# EAGLE schematic imu-6dof_tof_board (EAGLE 9.6.2)
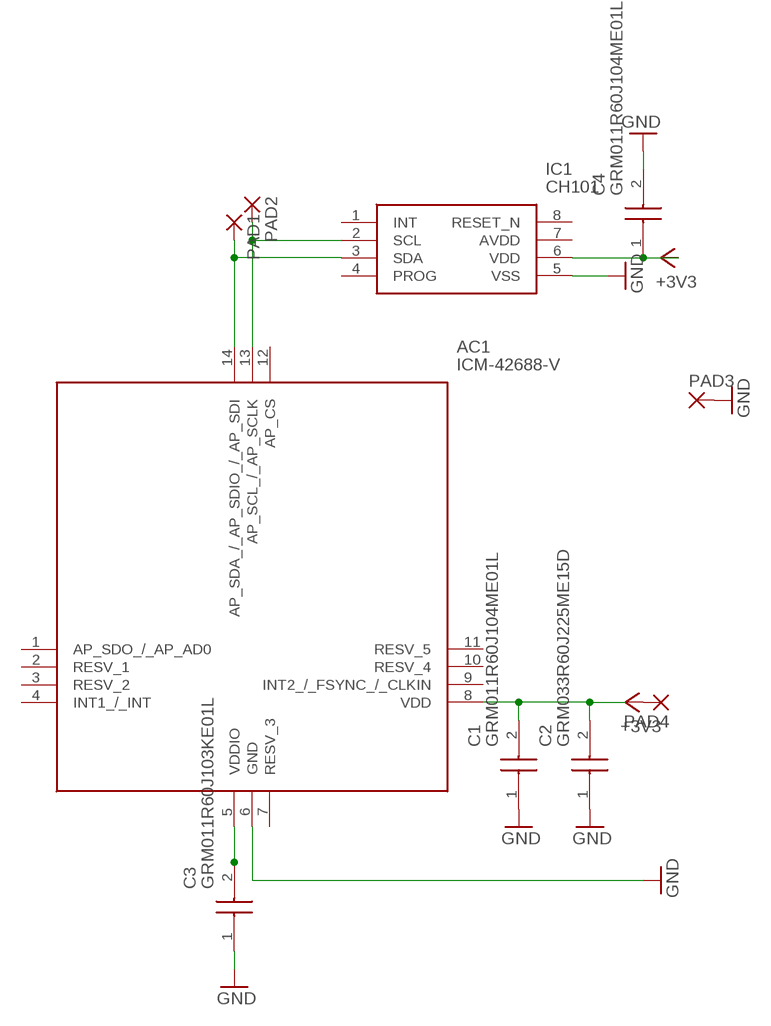
[diagram p0: schematic, sheet 1]

## Parts
AC1  ICM-42688-V  [IIM42352]
C1  GRM011R60J104ME01L  [CAPC0201X14N]
C2  GRM033R60J225ME15D  [CAPC0603X33N]
C3  GRM011R60J103KE01L  [CAPC0201X14N]
C4  GRM011R60J104ME01L  [CAPC0201X14N]
IC1  CH101  [CH101]
PAD1  SMD2  [SMD1,27-2,54]
PAD2  SMD2  [SMD1,27-2,54]
PAD3  SMD2  [SMD1,27-2,54]
PAD4  SMD2  [SMD1,27-2,54]

## Nets
+3V3: C4.1 IC1.6(VDD) PAD4.1(P)
GND: AC1.6(GND) C1.1 C2.1 C3.1 C4.2 IC1.5(VSS) PAD3.1(P)
N$1: AC1.14(AP_SDA_/_AP_SDIO_/_AP_SDI) IC1.3(SDA) PAD1.1(P)
N$2: AC1.13(AP_SCL_/_AP_SCLK) IC1.2(SCL) PAD2.1(P)
N$3: AC1.5(VDDIO) C3.2
N$4: AC1.8(VDD) C1.2 C2.2
Unconnected: AC1.1(AP_SDO_/_AP_AD0) AC1.2(RESV_1) AC1.3(RESV_2) AC1.4(INT1_/_INT) AC1.7(RESV_3) AC1.9(INT2_/_FSYNC_/_CLKIN) AC1.10(RESV_4) AC1.11(RESV_5) AC1.12(AP_CS) IC1.1(INT) IC1.4(PROG) IC1.7(AVDD) IC1.8(RESET_N)

## Library data of the parts
AC1 = ICM-42688-V:ICM-42688-V: High Precision 6-Axis MEMS MotionTracking? Device with Advanced Sensor Fusion Library Source: Datasheet <https://3cfeqx1hf82y3xcoull08ihx-wpengine.netdna-ssl.com/wp-content/uploads/2021/04/DS-000439-ICM-42688-V-v1.1.pdf>; DESCRIPTION: High Precision 6-Axis MEMS MotionTracking? Device with Advanced Sensor Fusion Library; HEIGHT: mm; MANUFACTURER_NAME: TDK; MANUFACTURER_PART_NUMBER: ICM-42688-V; MOUSER_PART_NUMBER: 410-ICM-42688-V; MOUSER_PRICE-STOCK: https://www.mouser.co.uk/ProductDetail/TDK-InvenSense/ICM-42688-V?qs=iLbezkQI%252Bsj8X%2F1CCh43jQ%3D%3D
C1 C4 = Capacitor_0201_0.1:GRM011R60J104ME01L: Multilayer Ceramic Capacitors MLCC - SMD/SMT Source: Datasheet <https://www.murata.com/en-eu/api/pdfdownloadapi?cate=luCeramicCapacitorsSMD&partno=GRM011R60J104ME01#>; DESCRIPTION: Multilayer Ceramic Capacitors MLCC - SMD/SMT; HEIGHT: 0.138mm; MANUFACTURER_NAME: Murata Electronics; MANUFACTURER_PART_NUMBER: GRM011R60J104ME01L; MOUSER_PART_NUMBER: 81-GRM011R60J104ME1L; MOUSER_PRICE-STOCK: https://www.mouser.co.uk/ProductDetail/Murata-Electronics/GRM011R60J104ME01L?qs=hd1VzrDQEGgrOiW%2FuBfgqw%3D%3D
C2 = Capacitor_0603_2.2_v2:GRM033R60J225ME15D: Multilayer Ceramic Capacitors MLCC - SMD/SMT 0201 2.2uF 6.3volts *Derate Voltage/Temp Source: Datasheet <https://datasheet.datasheetarchive.com/originals/distributors/DKDS42/DSANUWW0047682.pdf>; DESCRIPTION: Multilayer Ceramic Capacitors MLCC - SMD/SMT 0201 2.2uF 6.3volts *Derate Voltage/Temp; HEIGHT: 0.33mm; MANUFACTURER_NAME: Murata Electronics; MANUFACTURER_PART_NUMBER: GRM033R60J225ME15D; MOUSER_PART_NUMBER: 81-GRM033R60J225ME5D; MOUSER_PRICE-STOCK: https://www.mouser.co.uk/ProductDetail/Murata-Electronics/GRM033R60J225ME15D?qs=F5vmRhUsTTp8%2FHfTnu24UA%3D%3D
C3 = Capacitor_0201_0.001:GRM011R60J103KE01L: Capacitor GRM01 L=0.25mm W=0.125mm T=0.125mm Source: Datasheet <https://psearch.en.murata.com/capacitor/product/GRM011R60J103KE01#.html>; DESCRIPTION: Capacitor GRM01 L=0.25mm W=0.125mm T=0.125mm; HEIGHT: 0.138mm; MANUFACTURER_NAME: Murata Electronics; MANUFACTURER_PART_NUMBER: GRM011R60J103KE01L
IC1 = CH101:CH101: Ultrasonic ToF (Time-of-Flight) Sensors, Operating Range=4cm to 1.2m, Current Consumption=13?A (1 sample/sec:10cm max range) Source: Datasheet <https://3cfeqx1hf82y3xcoull08ihx-wpengine.netdna-ssl.com/wp-content/uploads/2021/01/DS-000331-CH101-v1.4.pdf>; DESCRIPTION: Ultrasonic ToF (Time-of-Flight) Sensors, Operating Range=4cm to 1.2m, Current Consumption=13?A (1 sample/sec:10cm max range); HEIGHT: 1.36mm; MANUFACTURER_NAME: TDK; MANUFACTURER_PART_NUMBER: CH101
PAD1-PAD4 = wirepad:SMD2: SMD PAD